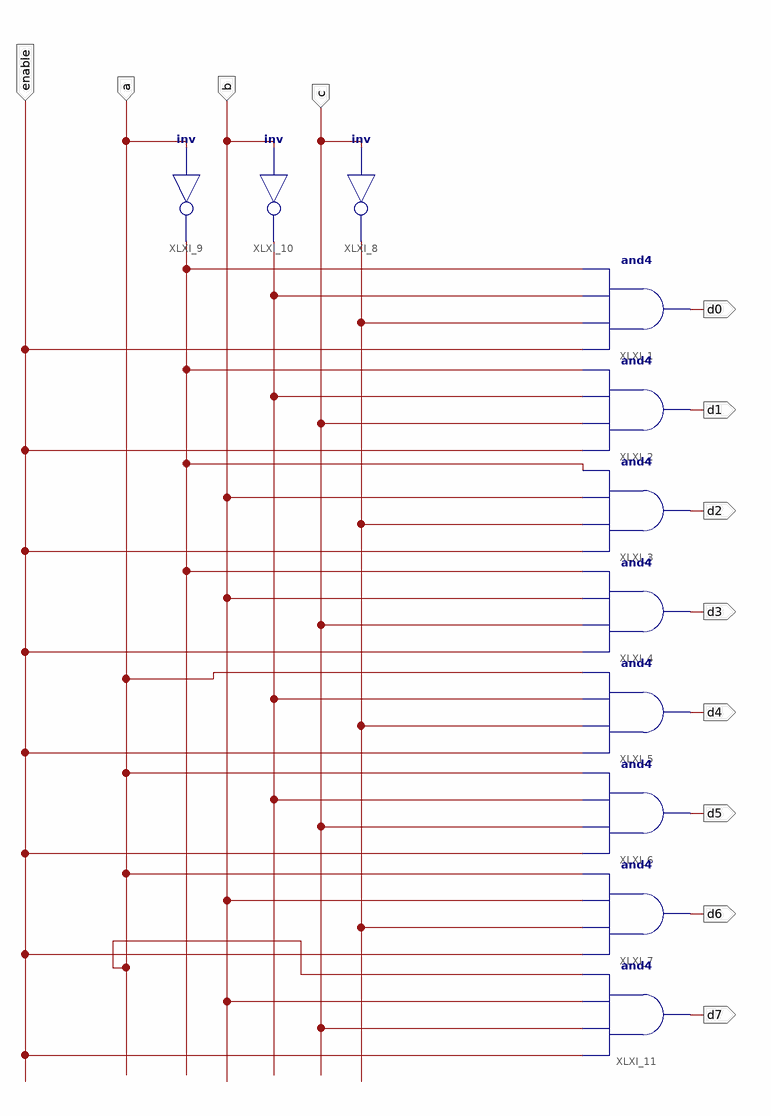
[diagram p0: schematic sheet 1]
// Xilinx ISE schematic sprinkler_circuit_updated.sch (spartan3e) as structural Verilog: 11 symbols, 12 ports
module sprinkler_circuit_updated (
  input  c,
  input  b,
  input  enable,
  input  a,
  output d0,
  output d1,
  output d2,
  output d3,
  output d4,
  output d5,
  output d6,
  output d7
);

  wire XLXN_1, XLXN_2, XLXN_10;

  and XLXI_1 (d0, enable, XLXN_2, XLXN_1, XLXN_10);
  and XLXI_2 (d1, enable, c, XLXN_1, XLXN_10);
  and XLXI_3 (d2, enable, XLXN_2, b, XLXN_10);
  and XLXI_4 (d3, enable, c, b, XLXN_10);
  and XLXI_5 (d4, enable, XLXN_2, XLXN_1, a);
  and XLXI_6 (d5, enable, c, XLXN_1, a);
  and XLXI_7 (d6, enable, XLXN_2, b, a);
  not XLXI_8 (XLXN_2, c);
  not XLXI_9 (XLXN_10, a);
  not XLXI_10 (XLXN_1, b);
  and XLXI_11 (d7, enable, c, b, a);
endmodule
